# Altium schematic sheet aiwac_LCD.SchDoc
size A4
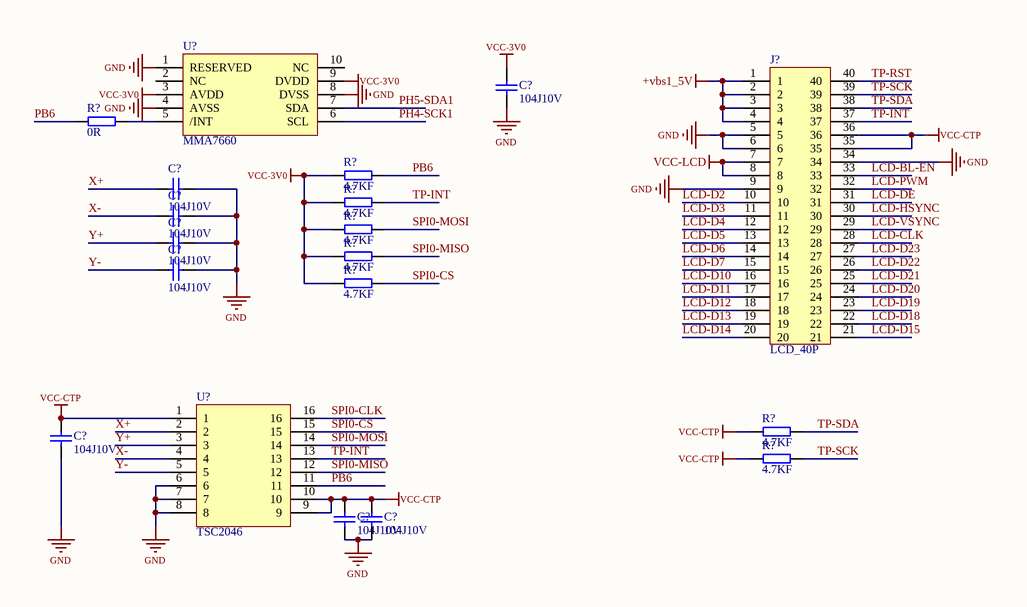
[diagram p0: aiwac_LCD.SchDoc]

## Parts
(Parts that share a designator on the sheet are numbered #1, #2 ... from top to bottom, then left to right.)
C?#1  104J10V  [C0402]
C?#2  104J10V  [C0402]
C?#3  104J10V  [C0402]
C?#4  104J10V  [C0402]
C?#5  104J10V  [C0402]
C?#6  104J10V  [C0402]
C?#7  104J10V  [C0402]
C?#8  104J10V  [C0402]
J?  LCD_40P  [LCD P40]
R?#1  0R  [R0402]
R?#2  4.7KF  [R0402]
R?#3  4.7KF  [R0402]
R?#4  4.7KF  [R0402]
R?#5  4.7KF  [R0402]
R?#6  4.7KF  [R0402]
R?#7  4.7KF  [R0402]
R?#8  4.7KF  [R0402]
U?#1  MMA7660
U?#2  TSC2046

## Nets
+vbs1_5V: J?.1 J?.2 J?.3 J?.4
GND: C?#1.2 C?#2.2 C?#3.2 C?#4.2 C?#5.2 C?#6.2 C?#7.2 C?#8.2 J?.5 J?.6 J?.9 J?.34 U?#1.1(RESERVED) U?#1.4(AVSS) U?#1.8(DVSS) U?#2.6 U?#2.7 U?#2.8
VCC-3V0: C?#1.1 R?#2.1 R?#3.1 R?#4.1 R?#5.1 R?#6.1 U?#1.3(AVDD) U?#1.9(DVDD)
VCC-CTP: C?#6.1 C?#7.1 C?#8.1 J?.35 J?.36 R?#7.1 R?#8.1 U?#2.1 U?#2.9 U?#2.10
VCC-LCD: J?.7 J?.8
LCD-BL-EN: J?.33
LCD-CLK: J?.28
LCD-D2: J?.10
LCD-D3: J?.11
LCD-D4: J?.12
LCD-D5: J?.13
LCD-D6: J?.14
LCD-D7: J?.15
LCD-D10: J?.16
LCD-D11: J?.17
LCD-D12: J?.18
LCD-D13: J?.19
LCD-D14: J?.20
LCD-D15: J?.21
LCD-D18: J?.22
LCD-D19: J?.23
LCD-D20: J?.24
LCD-D21: J?.25
LCD-D22: J?.26
LCD-D23: J?.27
LCD-DE: J?.31
LCD-HSYNC: J?.30
LCD-PWM: J?.32
LCD-VSYNC: J?.29
PB6: R?#1.1 R?#2.2 U?#2.11
PH4-SCK1: U?#1.6(SCL)
PH5-SDA1: U?#1.7(SDA)
SPI0-CLK: U?#2.16
SPI0-CS: R?#6.2 U?#2.15
SPI0-MISO: R?#5.2 U?#2.12
SPI0-MOSI: R?#4.2 U?#2.14
TP-INT: J?.37 R?#3.2 U?#2.13
TP-RST: J?.40
TP-SCK: J?.39 R?#8.2
TP-SDA: J?.38 R?#7.2
X+: C?#2.1 U?#2.2
X-: C?#3.1 U?#2.4
Y+: C?#4.1 U?#2.3
Y-: C?#5.1 U?#2.5
NetR?#1_2: R?#1.2 U?#1.5(/INT)

Not connected (* = marked no-connect by the designer): U?#1 2(NC) 10(NC)

## Library data of the parts
C?#1-C?#8 = C0402X7R-104J10V: 贴片电容-陶瓷; 规格型号: 100nF±5%_10V_X7R_C0402; 生产商: 风华 三星; 供应商: *; 备注: *
R?#1 = R0402-0RF: 贴片电阻-通用; 生产商: 厚声 国巨; 规格型号: 0R_1/10W_±200ppm_R0402; 货品编码: 无样品无编码; 备注: *; 供应商: *
R?#2-R?#8 = R0402-4.7KF: 贴片电阻-通用
U?#1 = MMA7660: IC-SENSOR-MMA7660FCT